# Altium schematic sheet RS485_Clock.SchDoc
size A4 portrait
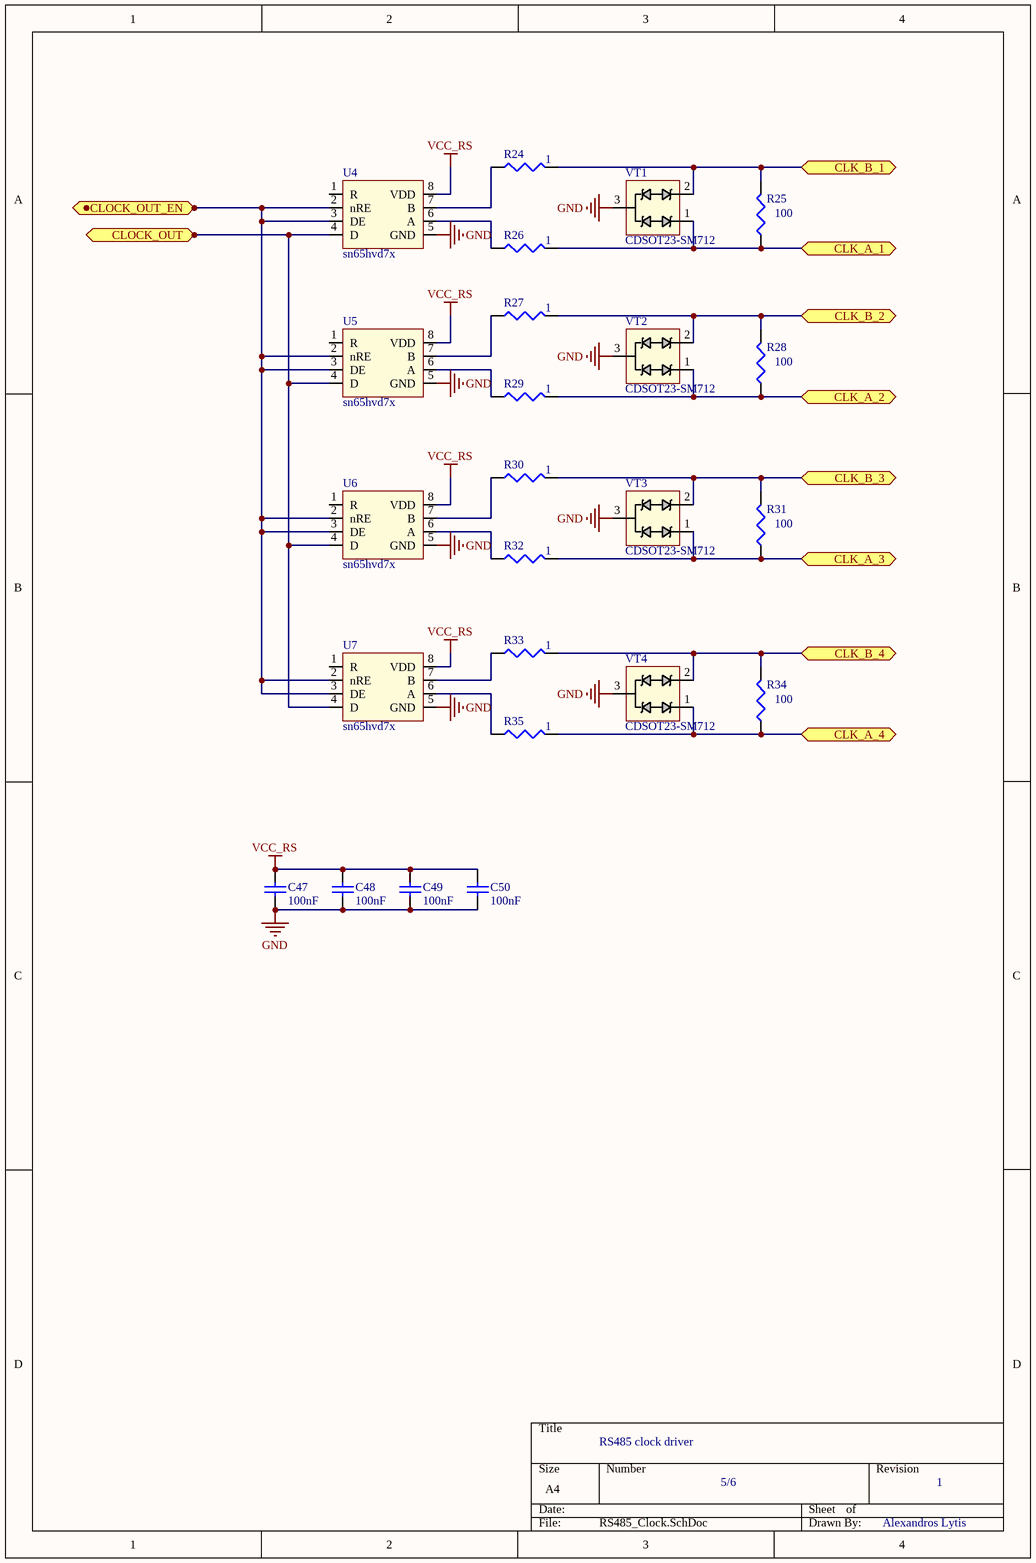
[diagram p0: RS485_Clock.SchDoc]

## Parts
C47  value 100nF  [CAP0603]  (hidden comment: Cap Semi)
C48  value 100nF  [CAP0603]  (hidden comment: Cap Semi)
C49  value 100nF  [CAP0603]  (hidden comment: Cap Semi)
C50  value 100nF  [CAP0603]  (hidden comment: Cap Semi)
R24  value 1  [RES0603]  (hidden comment: p-p)
R25  value 100  [RES0603]  (hidden comment: p-p)
R26  value 1  [RES0603]  (hidden comment: p-p)
R27  value 1  [RES0603]  (hidden comment: p-p)
R28  value 100  [RES0603]  (hidden comment: p-p)
R29  value 1  [RES0603]  (hidden comment: p-p)
R30  value 1  [RES0603]  (hidden comment: p-p)
R31  value 100  [RES0603]  (hidden comment: p-p)
R32  value 1  [RES0603]  (hidden comment: p-p)
R33  value 1  [RES0603]  (hidden comment: p-p)
R34  value 100  [RES0603]  (hidden comment: p-p)
R35  value 1  [RES0603]  (hidden comment: p-p)
U4  sn65hvd7x  [SOP127P600-8N]
U5  sn65hvd7x  [SOP127P600-8N]
U6  sn65hvd7x  [SOP127P600-8N]
U7  sn65hvd7x  [SOP127P600-8N]
VT1  CDSOT23-SM712  [SOT190P230X117-3N]
VT2  CDSOT23-SM712  [SOT190P230X117-3N]
VT3  CDSOT23-SM712  [SOT190P230X117-3N]
VT4  CDSOT23-SM712  [SOT190P230X117-3N]

## Ports
CLK_A_1, CLK_A_2, CLK_A_3, CLK_A_4, CLK_B_1, CLK_B_2, CLK_B_3, CLK_B_4, CLOCK_OUT, CLOCK_OUT_EN

## Nets
GND: C47.1 C48.1 C49.1 C50.1 U4.5(GND) U5.5(GND) U6.5(GND) U7.5(GND) VT1.3 VT2.3 VT3.3 VT4.3
VCC_RS: C47.2 C48.2 C49.2 C50.2 U4.8(VDD) U5.8(VDD) U6.8(VDD) U7.8(VDD)
CLK_A_1: R25.1 R26.2 VT1.1 ; port CLK_A_1
CLK_A_2: R28.1 R29.2 VT2.1 ; port CLK_A_2
CLK_A_3: R31.1 R32.2 VT3.1 ; port CLK_A_3
CLK_A_4: R34.1 R35.2 VT4.1 ; port CLK_A_4
CLK_B_1: R24.2 R25.2 VT1.2 ; port CLK_B_1
CLK_B_2: R27.2 R28.2 VT2.2 ; port CLK_B_2
CLK_B_3: R30.2 R31.2 VT3.2 ; port CLK_B_3
CLK_B_4: R33.2 R34.2 VT4.2 ; port CLK_B_4
CLOCK_OUT: U4.4(D) U5.4(D) U6.4(D) U7.4(D) ; port CLOCK_OUT
CLOCK_OUT_EN: U4.2(nRE) U4.3(DE) U5.2(nRE) U5.3(DE) U6.2(nRE) U6.3(DE) U7.2(nRE) U7.3(DE) ; port CLOCK_OUT_EN
NetR24_1: R24.1 U4.7(B)
NetR26_1: R26.1 U4.6(A)
NetR27_1: R27.1 U5.7(B)
NetR29_1: R29.1 U5.6(A)
NetR30_1: R30.1 U6.7(B)
NetR32_1: R32.1 U6.6(A)
NetR33_1: R33.1 U7.7(B)
NetR35_1: R35.1 U7.6(A)

Not connected (* = marked no-connect by the designer): U4 1(R); U5 1(R); U6 1(R); U7 1(R)

## Notes on the sheet
- RS485 clock driver
- 5/6
- 1
- Alexandros Lytis

## Library data of the parts
C47-C50 = Cap Semi: Capacitor (Semiconductor SIM Model); Published: 8-Jun-2000; LatestRevisionDate: 29-May-2009; LatestRevisionNote: IPC-7351 Footprint Added.; PackageReference: C1206; Publisher: Altium Limited; PackageDescription: Chip Capacitor
R24-R35 = Res3: Resistor; Published: 8-Jun-2000; LatestRevisionDate: 29-May-2009; LatestRevisionNote: IPC-7351 Footprint Added.; PackageReference: J1-0603; Publisher: Altium Limited; PackageDescription: Chip Resistor